# Altium schematic sheet Input filter.SchDoc
size A4; SheetNumber: 6; SheetTotal: 8
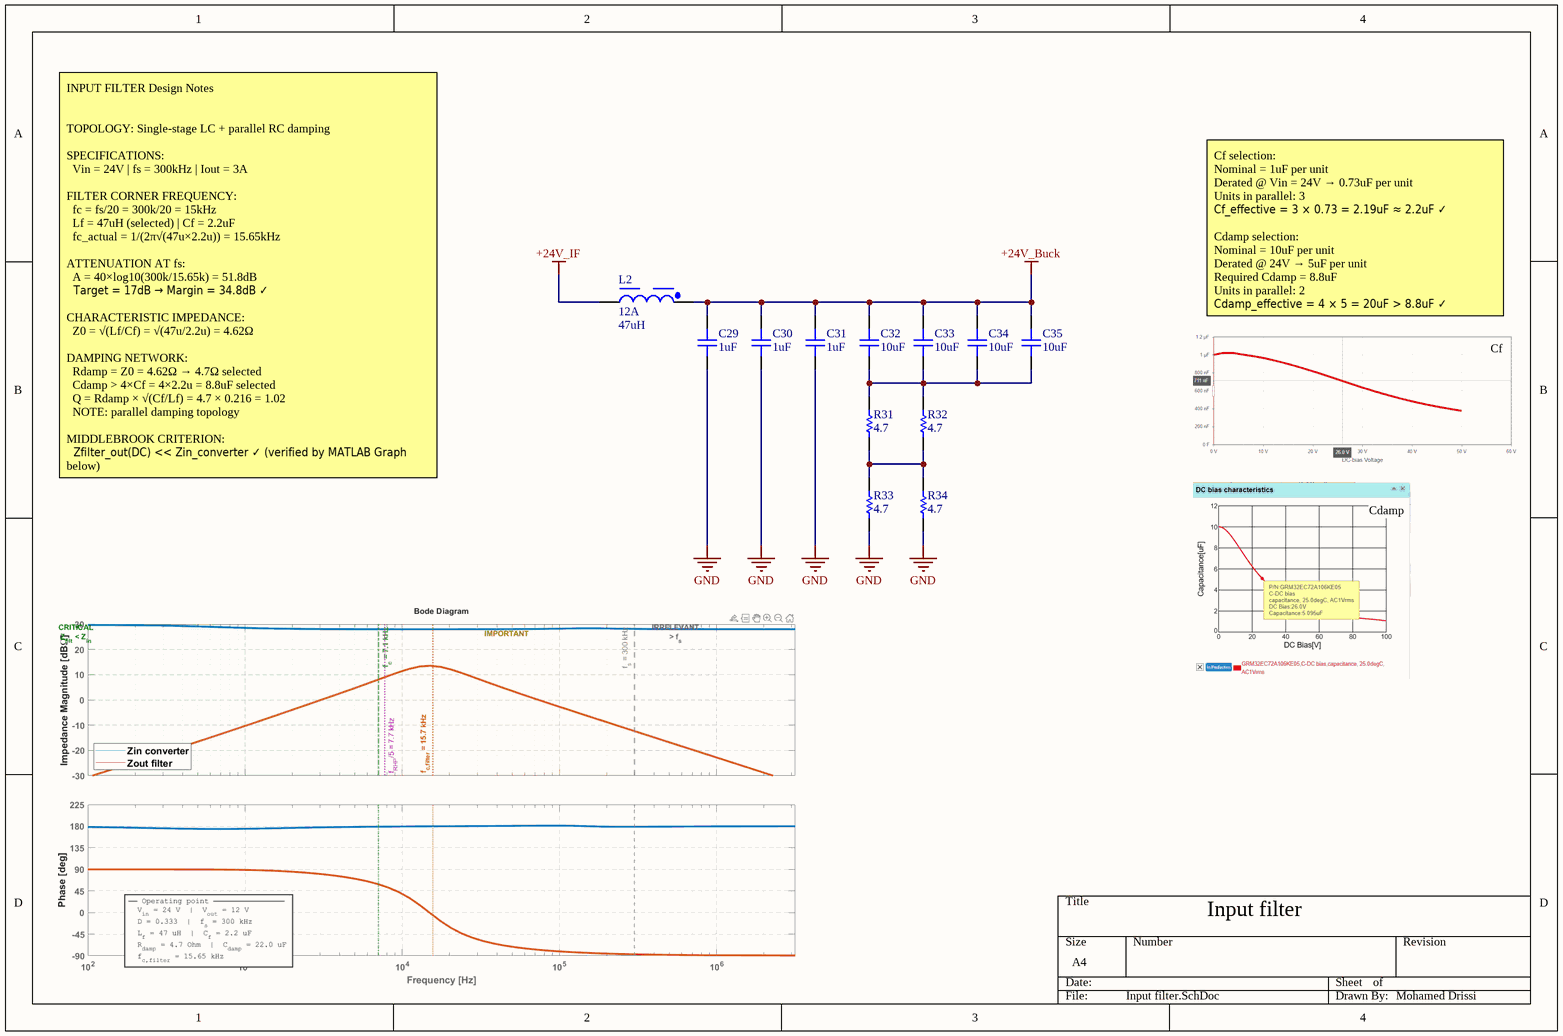
[diagram p0: Input filter.SchDoc]

## Parts
C29  Capacitance: 1uF  [cap_1206]  (hidden comment: 885382208005)
C30  Capacitance: 1uF  [cap_1206]  (hidden comment: 885382208005)
C31  Capacitance: 1uF  [cap_1206]  (hidden comment: 885382208005)
C32  Capacitance: 10uF  [cap_1210]  (hidden comment: 885012209073)
C33  Capacitance: 10uF  [cap_1210]  (hidden comment: 885012209073)
C34  Capacitance: 10uF  [cap_1210]  (hidden comment: 885012209073)
C35  Capacitance: 10uF  [cap_1210]  (hidden comment: 885012209073)
L2  Current Rating: 12A  Inductance: 47uH  [7443634700]  (hidden comment: 7443634700)
R31  Resistance: 4.7  [RES_2512]  (hidden comment: MFCR2512F4R70Q9R)
R32  Resistance: 4.7  [RES_2512]  (hidden comment: MFCR2512F4R70Q9R)
R33  Resistance: 4.7  [RES_2512]  (hidden comment: MFCR2512F4R70Q9R)
R34  Resistance: 4.7  [RES_2512]  (hidden comment: MFCR2512F4R70Q9R)

## Nets
+24V_Buck: C29.2 C30.2 C31.2 C32.2 C33.2 C34.2 C35.2 L2.2
+24V_IF: L2.1
GND: C29.1 C30.1 C31.1 R33.1 R34.1
NetC32_1: C32.1 C33.1 C34.1 C35.1 R31.2 R32.2
NetR31_1: R31.1 R32.1 R33.2 R34.2

## Notes on the sheet
- Cf selection:
  Nominal = 1uF per unit
  Derated @ Vin = 24V → 0.73uF per unit
  Units in parallel: 3
  Cf_effective = 3 × 0.73 = 2.19uF ≈ 2.2uF ✓
  Cdamp selection:
  Nominal = 10uF per unit
  Derated @ 24V → 5uF per unit
  Required Cdamp = 8.8uF
  Units in parallel: 2
  Cdamp_effective = 4 × 5 = 20uF > 8.8uF ✓
- Cf
- INPUT FILTER Design Notes
  TOPOLOGY: Single-stage LC + parallel RC damping
  SPECIFICATIONS:
  Vin = 24V | fs = 300kHz | Iout = 3A
  FILTER CORNER FREQUENCY:
  fc = fs/20 = 300k/20 = 15kHz
  Lf = 47uH (selected) | Cf = 2.2uF
  fc_actual = 1/(2π√(47u×2.2u)) = 15.65kHz
  ATTENUATION AT fs:
  A = 40×log10(300k/15.65k) = 51.8dB
  Target = 17dB → Margin = 34.8dB ✓
  CHARACTERISTIC IMPEDANCE:
  Z0 = √(Lf/Cf) = √(47u/2.2u) = 4.62Ω
  DAMPING NETWORK:
  Rdamp = Z0 = 4.62Ω → 4.7Ω selected
  Cdamp > 4×Cf = 4×2.2u = 8.8uF selected
  Q = Rdamp × √(Cf/Lf) = 4.7 × 0.216 = 1.02
  NOTE: parallel damping topology
  MIDDLEBROOK CRITERION:
  Zfilter_out(DC) << Zin_converter ✓ (verified by MATLAB Graph below)
- Cdamp
- Input filter
- Mohamed Drissi

## Library data of the parts
C29-C31 = Wurth 885382208005: WCAP-CSST 1206 (3216Metric) ceramic capacitor 0.126Lx0.063W 3.20mmx1.60mm X7R ±10% 1muF; Manufacturer: Wurth Elektronik; Manufacturer Lifecycle Status: ACTIVE; Insulation Resistance: 500MΩ; Voltage Rating: 50V; YEOL: 1 = Estimated lifetime > 10 years; Supplier: RS; Supplier Part Number: 1855579; Manufacturer Part Number: 885382208005; RoHS: Compliant; Category: Ceramic Capacitors; Stock: 1375; Pricing: 25=0,187, 250=0,174, 625=0,158, 1250=0,139, 2500=0,118 (EUR); Case/Package: 1206; Dielectric: X7R; Height: 1.6mm; Length: 3.2mm; Lifecycle Status: Production; Max Operating Temperature: 125°C; Min Operating Temperature: -55°C; Voltage Rating (DC): 50V; Width: 1.6mm; ComponentLink1URL: https://datasheet.octopart.com:443/885382208005-W%C3%BCrth-Elektronik-datasheet-137006684.pdf?src-supplier=Wurth+Elektronik; ComponentLink1Description: https://datasheet.octopart.com:443/885382208005-W%C3%BCrth-Elektronik-datasheet-137006684.pdf?src-supplier=Wurth+Elektronik
C32-C35 = Wurth 885012209073: Cap, 10Uf, 50V, Mlcc, 1210 Rohs Compliant: Yes |Würth Elektronik 885012209073; Manufacturer: Wurth Elektronik; Manufacturer Lifecycle Status: ACTIVE; Insulation Resistance: 10MΩ; Material: Ceramic; Tolerance: 10%; YEOL: 1 = Estimated lifetime > 10 years; Supplier: RS; Supplier Part Number: 2571123; Manufacturer Part Number: 885012209073; RoHS: Compliant; Category: Ceramic Capacitors; Stock: 1289; Pricing: 10=1,153, 100=1,081, 200=1,009, 400=0,851, 500=0,799 (EUR); Case/Package: 1210; Height: 2.5mm; Length: 3.2mm; Lifecycle Status: Production; Max Operating Temperature: 125°C; Min Operating Temperature: -55°C; Voltage Rating: 50V; Width: 2.5mm; ComponentLink1URL: https://datasheet.octopart.com:443/885012209073-Wurth-Elektronik-datasheet-166092699.pdf?src-supplier=Newark; ComponentLink1Description: https://datasheet.octopart.com:443/885012209073-Wurth-Elektronik-datasheet-166092699.pdf?src-supplier=Newark; ComponentLink2URL: https://datasheet.octopart.com:443/885012209073-W%C3%BCrth-Elektronik-datasheet-137006727.pdf?src-supplier=Wurth+Elektronik; ComponentLink2Description: https://datasheet.octopart.com:443/885012209073-W%C3%BCrth-Elektronik-datasheet-137006727.pdf?src-supplier=Wurth+Elektronik
L2 = Wurth 7443634700: Power Choke Shielded Wirewound 47uH 15% 100KHz Ferrite 12A 0.01342Ohm DCR Automotive T/R; Manufacturer: Wurth Elektronik; Manufacturer Lifecycle Status: ACTIVE; DC Resistance (DCR): 12.2mΩ; Frequency: 10MHz; Saturation Current: 7.5A; YEOL: 1 = Estimated lifetime > 10 years; Supplier: RS; Supplier Part Number: 7445062P; Manufacturer Part Number: 7443634700; RoHS: Compliant; Category: Fixed Inductors; Stock: 86; Pricing: 10=5,04, 20=4,8, 50=4,49, 100=4,45 (EUR); Ambient Temperature Range High: 75°C; Ambient Temperature Range Low: -40°C; Case/Package: Nonstandard; Composition: Wirewound; Core Material: Ferrite; Depth: 21mm; Height: 13.5mm; Height - Seated (Max): 14.5034mm; Inductance Tolerance: 15%; Lead Free: Lead Free; Length: 20.8mm; Lifecycle Status: Production; Max DC Current: 12A; Max Operating Temperature: 125°C; Min Operating Temperature: -40°C; Mounting Technology: Surface Mount; Pins: 2; REACH SVHC: Unknown; RMS Current (Irms): 12A; Self Resonant Frequency: 10MHz; Shielding: Shielded; Termination: SMD/SMT; Test Frequency: 100kHz; Tolerance: 15%; Width: 20.5mm; ComponentLink1URL: https://datasheet.octopart.com:443/7443634700-Wurth-Elektronik-datasheet-168489618.pdf?src-supplier=Wurth+Elektronik; ComponentLink1Description: https://datasheet.octopart.com:443/7443634700-Wurth-Elektronik-datasheet-168489618.pdf?src-supplier=Wurth+Elektronik; ComponentLink2URL: https://datasheet.octopart.com:443/7443634700-W%C3%BCrth-Elektronik-datasheet-142021069.pdf?src-supplier=Upverter; ComponentLink2Description: https://datasheet.octopart.com:443/7443634700-W%C3%BCrth-Elektronik-datasheet-142021069.pdf?src-supplier=Upverter; ComponentLink3URL: https://datasheet.octopart.com:443/7443634700-Wurth-Elektronik-datasheet-181535134.pdf?src-supplier=Farnell; ComponentLink3Description: https://datasheet.octopart.com:443/7443634700-Wurth-Elektronik-datasheet-181535134.pdf?src-supplier=Farnell; ComponentLink4URL: https://datasheet.octopart.com:443/7443634700-W%C3%BCrth-Elektronik-datasheet-62112327.pdf?src-supplier=Future+Electronics; ComponentLink4Description: https://datasheet.octopart.com:443/7443634700-W%C3%BCrth-Elektronik-datasheet-62112327.pdf?src-supplier=Future+Electronics; ComponentLink5URL: https://datasheet.octopart.com:443/7443634700-W%C3%BCrth-Elektronik-datasheet-11479040.pdf?src-supplier=Newark; ComponentLink5Description: https://datasheet.octopart.com:443/7443634700-W%C3%BCrth-Elektronik-datasheet-11479040.pdf?src-supplier=Newark; ComponentLink6URL: https://datasheet.octopart.com:443/7443634700-Wurth-Elektronik-datasheet-182429432.pdf?src-supplier=Newark; ComponentLink6Description: https://datasheet.octopart.com:443/7443634700-Wurth-Elektronik-datasheet-182429432.pdf?src-supplier=Newark; ComponentLink7URL: https://datasheet.octopart.com:443/7443634700-W%C3%BCrth-Elektronik-datasheet-112299913.pdf?src-supplier=Newark; ComponentLink7Description: https://datasheet.octopart.com:443/7443634700-W%C3%BCrth-Elektronik-datasheet-112299913.pdf?src-supplier=Newark
R31-R34 = Resion MFCR2512F4R70Q9R: 4.7 Ohm 1% 2W 50PPM/C; Manufacturer: Resion; Supplier: DigiKey; Supplier Part Number: 4506-MFCR2512F4R70Q9RCT-ND; Manufacturer Part Number: MFCR2512F4R70Q9R; Category: Chip SMD Resistors; Stock: 1143; Pricing: 1=0,43, 10=0,238, 25=0,196, 50=0,1722, 100=0,1533, 250=0,13416, 500=0,12316, 1000=0,11441 (USD)